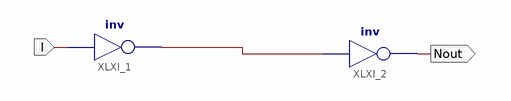
[diagram p0: schematic sheet 1]
// Xilinx ISE schematic getOutput.sch (spartan3e) as structural Verilog: 2 symbols, 2 ports
module getOutput (
  input  I,
  output Nout
);

  wire XLXN_1;

  not XLXI_1 (XLXN_1, I);
  not XLXI_2 (Nout, XLXN_1);
endmodule
